# Altium schematic sheet MCU Schematic.SchDoc
size A4; SheetNumber: 2; SheetTotal: 3
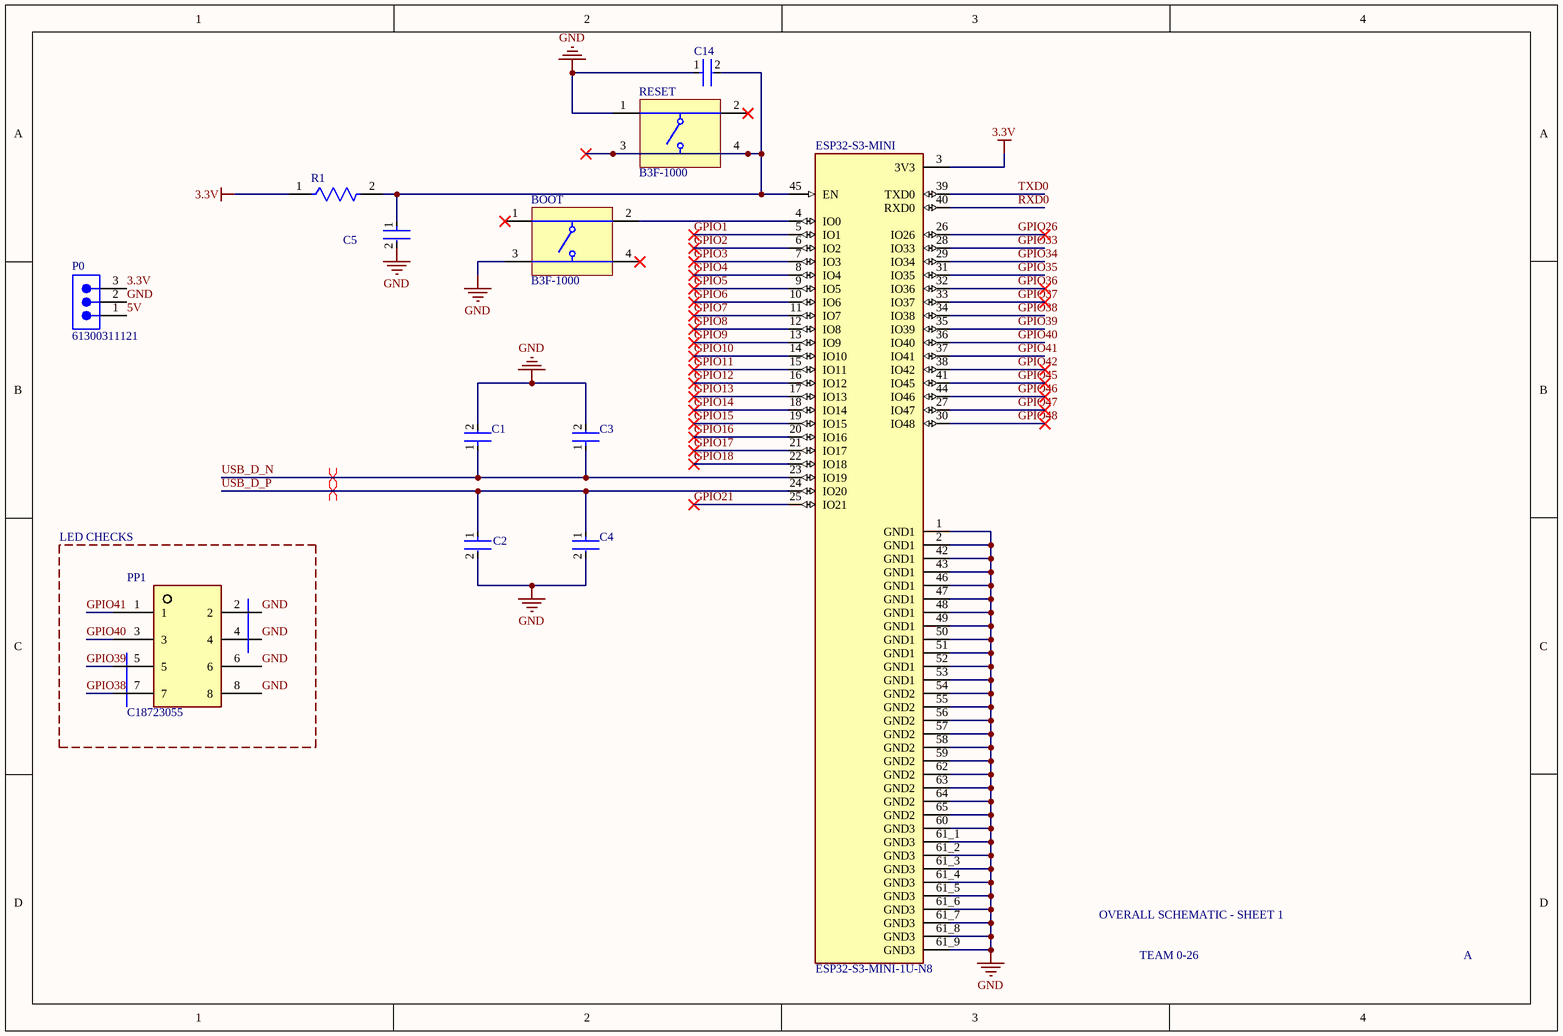
[diagram p0: MCU Schematic.SchDoc]

## Parts
BOOT  B3F-1000  [OMRON-B3F-1000-4_V]
C1  CC0805KKX7R7BB105  [FP-CC0805-0_85-MFG]  (value not drawn)
C2  CC0805KKX7R7BB105  [FP-CC0805-0_85-MFG]  (value not drawn)
C3  CC0805KRX7R9BB104  [FP-CC0805-0_85-MFG]  (value not drawn)
C4  CC0805KRX7R9BB104  [FP-CC0805-0_85-MFG]  (value not drawn)
C5  CC0805KRX7R9BB104  [FP-CC0805-0_85-MFG]  (value not drawn)
C14  CC0805KRX7R9BB104  [FP-CC0805-0_85-MFG]  (value not drawn)
ESP32-S3-MINI  ESP32-S3-MINI-1U-N8  [XCVR_ESP32-S3-MINI-1U-N8]
P0  61300311121  [61300311121]
PP1  C18723055  [2541FV-2×4P]
R1  RN73C1J10KB  [FP-RN731J-MFG]  (value not drawn)
RESET  B3F-1000  [OMRON-B3F-1000-4_V]

## Blocks framed on the sheet
LED CHECKS: PP1

## Nets
3.3V: ESP32-S3-MINI.3(3V3) P0.3 R1.1
GND: BOOT.3 C1.2 C2.2 C3.2 C4.2 C5.2 C14.1 ESP32-S3-MINI.1(GND1) ESP32-S3-MINI.2(GND1) ESP32-S3-MINI.42(GND1) ESP32-S3-MINI.43(GND1) ESP32-S3-MINI.46(GND1) ESP32-S3-MINI.47(GND1) ESP32-S3-MINI.48(GND1) ESP32-S3-MINI.49(GND1) ESP32-S3-MINI.50(GND1) ESP32-S3-MINI.51(GND1) ESP32-S3-MINI.52(GND1) ESP32-S3-MINI.53(GND1) ESP32-S3-MINI.54(GND2) ESP32-S3-MINI.55(GND2) ESP32-S3-MINI.56(GND2) ESP32-S3-MINI.57(GND2) ESP32-S3-MINI.58(GND2) ESP32-S3-MINI.59(GND2) ESP32-S3-MINI.60(GND3) ESP32-S3-MINI.61_1(GND3) ESP32-S3-MINI.61_2(GND3) ESP32-S3-MINI.61_3(GND3) ESP32-S3-MINI.61_4(GND3) ESP32-S3-MINI.61_5(GND3) ESP32-S3-MINI.61_6(GND3) ESP32-S3-MINI.61_7(GND3) ESP32-S3-MINI.61_8(GND3) ESP32-S3-MINI.61_9(GND3) ESP32-S3-MINI.62(GND2) ESP32-S3-MINI.63(GND2) ESP32-S3-MINI.64(GND2) ESP32-S3-MINI.65(GND2) P0.2 PP1.2 PP1.4 PP1.6 PP1.8 RESET.1
5V: P0.1
GPIO1: ESP32-S3-MINI.5(IO1)
GPIO2: ESP32-S3-MINI.6(IO2)
GPIO3: ESP32-S3-MINI.7(IO3)
GPIO4: ESP32-S3-MINI.8(IO4)
GPIO5: ESP32-S3-MINI.9(IO5)
GPIO6: ESP32-S3-MINI.10(IO6)
GPIO7: ESP32-S3-MINI.11(IO7)
GPIO8: ESP32-S3-MINI.12(IO8)
GPIO9: ESP32-S3-MINI.13(IO9)
GPIO10: ESP32-S3-MINI.14(IO10)
GPIO11: ESP32-S3-MINI.15(IO11)
GPIO12: ESP32-S3-MINI.16(IO12)
GPIO13: ESP32-S3-MINI.17(IO13)
GPIO14: ESP32-S3-MINI.18(IO14)
GPIO15: ESP32-S3-MINI.19(IO15)
GPIO16: ESP32-S3-MINI.20(IO16)
GPIO17: ESP32-S3-MINI.21(IO17)
GPIO18: ESP32-S3-MINI.22(IO18)
GPIO21: ESP32-S3-MINI.25(IO21)
GPIO26: ESP32-S3-MINI.26(IO26)
GPIO33: ESP32-S3-MINI.28(IO33)
GPIO34: ESP32-S3-MINI.29(IO34)
GPIO35: ESP32-S3-MINI.31(IO35)
GPIO36: ESP32-S3-MINI.32(IO36)
GPIO37: ESP32-S3-MINI.33(IO37)
GPIO38: ESP32-S3-MINI.34(IO38) PP1.7
GPIO39: ESP32-S3-MINI.35(IO39) PP1.5
GPIO40: ESP32-S3-MINI.36(IO40) PP1.3
GPIO41: ESP32-S3-MINI.37(IO41) PP1.1
GPIO42: ESP32-S3-MINI.38(IO42)
GPIO45: ESP32-S3-MINI.41(IO45)
GPIO46: ESP32-S3-MINI.44(IO46)
GPIO47: ESP32-S3-MINI.27(IO47)
GPIO48: ESP32-S3-MINI.30(IO48)
RXD0: ESP32-S3-MINI.40(RXD0)
TXD0: ESP32-S3-MINI.39(TXD0)
USB_D_N: C1.1 C3.1 ESP32-S3-MINI.23(IO19)
USB_D_P: C2.1 C4.1 ESP32-S3-MINI.24(IO20)
NetBOOT_2: BOOT.2 ESP32-S3-MINI.4(IO0)
NetC5_1: C5.1 C14.2 ESP32-S3-MINI.45(EN) R1.2 RESET.3 RESET.4

Not connected (* = marked no-connect by the designer): BOOT 1* 4*; RESET 2*

## Layout directives
differential pair: USB_D_N, USB_D_P

## Notes on the sheet
- OVERALL SCHEMATIC - SHEET 1
- TEAM 0-26
- A

## Library data of the parts
BOOT RESET = CMP-1677-00002-1: Tactile Switch, SPST-NO, 0.05 A, 5 to 24 V, -25 to 70 degC, 4-Pin THD, RoHS, Bulk; Shielding: Shielded; Gender: Female; Capacitance: -45 f; Voltage Rating: 150 V; Current Rating: 1.5 A; Radiation Hardening: No; Contact Plating: Gold; Height: 14.99 mm; Min Operating Temperature: -40 degC; Packaging: Tray; ComponentLink2Description: Datasheet; ComponentLink1URL: http://www.omron.com/; Lead Pitch: 1.27 mm; RoHSCompliant: true; Pins: 8; PackageReference: B3F-1000; Width: 25.4 mm; Contact Material: Brass; ComponentLink2URL: http://www.omron.com/ecb/products/pdf/en-b3f.pdf; PackageDescription: 4-Pin Through Hole Device, Body 6 x 6 mm; DatasheetVersion: Jan-15; ComponentLink1Description: Manufacturer URL; Package Quantity: 1080; Mount: Through Hole; Length: 18.34 mm; Max Operating Temperature: 70 degC
C1 C2 = CMP-03422-000001-1: CAP CER 1UF 16V X7R 0805; Manufacturer: Yageo; Material: Ceramic; Tolerance: 0.1; Voltage Rating: 16 V; Category: Cap; Capacitance: 1 uF; ComponentLink2Description: Datasheet; Automotive: No; Temperature Range High: +85°C; RoHS: TRUE; Footprint Url: http://www.yageo.com/exep/pages/download/literatures/UPY-C_GEN_24.pdf; Mouser Description: Multilayer Ceramic Capacitors MLCC - SMD/SMT 1.0uF 16V X7R 10%; Height: 0.95mm; Ipc Land Pattern Name: CAPC200125X85; Temperature: -30°C to +85°C; Lead Free: Yes; Value: 1 uF; Temperature Characteristic: X7R; Package: CC0805-0.85; Temperature Range Low: -30°C; Device Class L1: Passive Components; Device Class L3: Ceramic Capacitors; Octopart: https://octopart.com/cc0805kkx7r7bb105-yageo-8376555; Manufacturer Part Number: CC0805KKX7R7BB105; ComponentLink2URL: http://www.yageo.com/documents/recent/UPY-GPHC_Y5V_6.3V-to-50V_8.pdf; Device Class L2: Capacitors; Digikey Description: CAP CER 1UF 16V X7R 0805
C3-C5 C14 = CMP-2100-03606-3: CAP CER 0.1UF 50V X7R 0805; Manufacturer: Yageo; Tolerance: 0.1; Capacitance: 100 nF; Value: 100 nF; Material: Ceramic; Device Class L1: Passive Components; ComponentLink2Description: Datasheet; Package: CC0805-0.85; Manufacturer Part Number: CC0805KRX7R9BB104; Digikey Description: CAP CER 0.1UF 50V X7R 0805; Device Class L3: Ceramic Capacitors; Temperature: -30°C to +85°C; Temperature Characteristic: X7R; Voltage Rating: 50 V; Height: 0.95mm; RoHS: TRUE; Ipc Land Pattern Name: CAPC200125X85; Device Class L2: Capacitors; Category: Cap; Temperature Range Low: -30°C; Temperature Range High: +85°C; Mouser Description: Multilayer Ceramic Capacitors MLCC - SMD/SMT 100nF 50V X7R 10%; Footprint Url: http://www.yageo.com/exep/pages/download/literatures/UPY-C_GEN_24.pdf; Automotive: No; Octopart: https://octopart.com/cc0805krx7r9bb104-yageo-192993; Lead Free: Yes; ComponentLink2URL: http://www.yageo.com/documents/recent/UPY-GPHC_Y5V_6.3V-to-50V_8.pdf
ESP32-S3-MINI = ESP32-S3-MINI-1U-N8: Bluetooth, WiFi 802.11b/g/n, Bluetooth v5.0 Transceiver Module 2.4GHz Antenna Not Included, U.FL Surface Mount; MF: Espressif Systems; SnapEDA_Link: https://www.snapeda.com/parts/ESP32-S3-MINI-1U-N8/Espressif+Systems/view-part/?ref=snap; Package: VFQFN-56 Espressif Systems; Value: *; MP: ESP32-S3-MINI-1U-N8; Check_prices: https://www.snapeda.com/parts/ESP32-S3-MINI-1U-N8/Espressif+Systems/view-part/?ref=eda
P0 = CMP-1502-01062-3: NexarPartId: 32855521; Current Rating: 3A; Voltage Rating: 250V; Number of Positions: 3; Pitch: 2.54mm; Contact Resistance: 20mΩ; Connector Type: Male Pin; Gender: Male; REACH SVHC: Unknown; Packaging: Bulk; Contact Material: Copper; Min Operating Temperature: -40°C; Number of Rows: 1; Orientation: Vertical; RoHS: Compliant; Contact Plating: Gold; Max Operating Temperature: 105°C; Mount: Through Hole; Height: 8.94mm; Operating Supply Voltage: 250V; Number of Pins: 3; Contact Mating Length: 5.9944mm; Number of Contacts: 3; Color: Black; Lead Free: Lead Free; Lead Pitch: 2.54mm; Termination: Solder
PP1 = 2541FV-2x4P: -40℃~+105℃ 2 2.54mm 2.54mm 2x4P 3A 8P Square Hole Through Hole Top Plugin,P=2.54mm Female Headers ROHS
R1 = CMP-03211-006130-1: Thin Film Resistors RN 0603 10KΩ 0.1% 10ppm/°C; Manufacturer: TE Connectivity; Voltage Rating: 50V; Power Rating: 0.063W; Octopart: https://octopart.com/rn73c1j10kb-te+connectivity-47108040; RoHS: TRUE; Value: 10KΩ; Device Class L1: Passive Components; Manufacturer Part Number: RN73C1J10KB; ComponentLink2URL: https://www.te.com/commerce/DocumentDelivery/DDEController?Action=showdoc&DocId=Data+Sheet%7F1773270%7FP%7Fpdf%7FEnglish%7FENG_DS_1773270_P.pdf%7F9-1614352-9; Resistance: 10KΩ; Temperature Coefficient: 10ppm/°C; Device Class L2: Resistors; Temperature Range High: +155°C; Temperature: -55°C to +155°C; Series: RN73; Height: 0.55mm; Package: RN731J; octopart_url: https://octopart.com/rn73c1j10kb-te+connectivity-47108040; ComponentLink2Description: Datasheet; Temperature Range Low: -55°C; Composition: Thin Film; Ipc Land Pattern Name: RESC15580X45; Automotive: No; Lead Free: Yes; Device Class L3: Chip SMD Resistors; Category: Res; Tolerance: 0.1%